# Altium schematic sheet PowerDetective.SchDoc
size A4
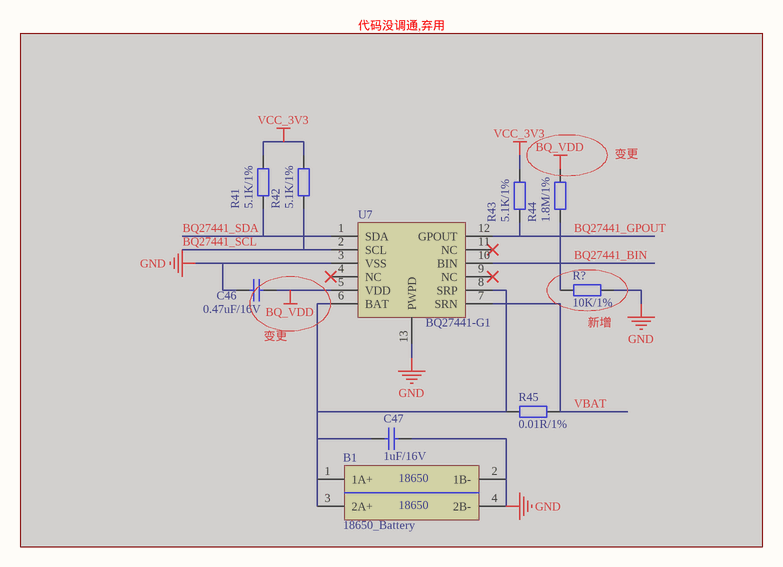
[diagram p0: PowerDetective.SchDoc]

## Parts
B1  18650_Battery  [18650*2]  (masked out: inside a compile mask, not in the netlist)
C46  0.47uF/16V  [C0402_L]  (masked out: inside a compile mask, not in the netlist)
C47  1uF/16V  [C0402_L]  (masked out: inside a compile mask, not in the netlist)
R41  5.1K/1%  [R0402_L]  (masked out: inside a compile mask, not in the netlist)
R42  5.1K/1%  [R0402_L]  (masked out: inside a compile mask, not in the netlist)
R43  5.1K/1%  [R0402_L]  (masked out: inside a compile mask, not in the netlist)
R44  1.8M/1%  [R0402_L]  (masked out: inside a compile mask, not in the netlist)
R45  0.01R/1%  [R1206_L]  (masked out: inside a compile mask, not in the netlist)
R?  10K/1%  [R0402_L]  (masked out: inside a compile mask, not in the netlist)
U7  BQ27441-G1  [VSON-12]  (masked out: inside a compile mask, not in the netlist)

## Notes on the sheet
- 代码没调通,弃用
- 变更
- (near C46) 变更
- (near R?) 新增
- (in symbol 18650_Battery) 18650

## Library data of the parts
B1 = 18650_Battery: 18650电池盒
C46 C47 = C: 贴片电容; BOM名称: 无极性贴片电容; 联系卖家，免费查找封装: 唯一出售店铺网址https://shop463601444.taobao.com
R41-R45 R? = R: 贴片电阻; 联系卖家，免费查找封装: 唯一出售店铺网址https://shop463601444.taobao.com; BOM名称: 贴片电阻
U7 = BQ27441: 电量监测计